# Altium schematic sheet Cpu.SchDoc
size A4
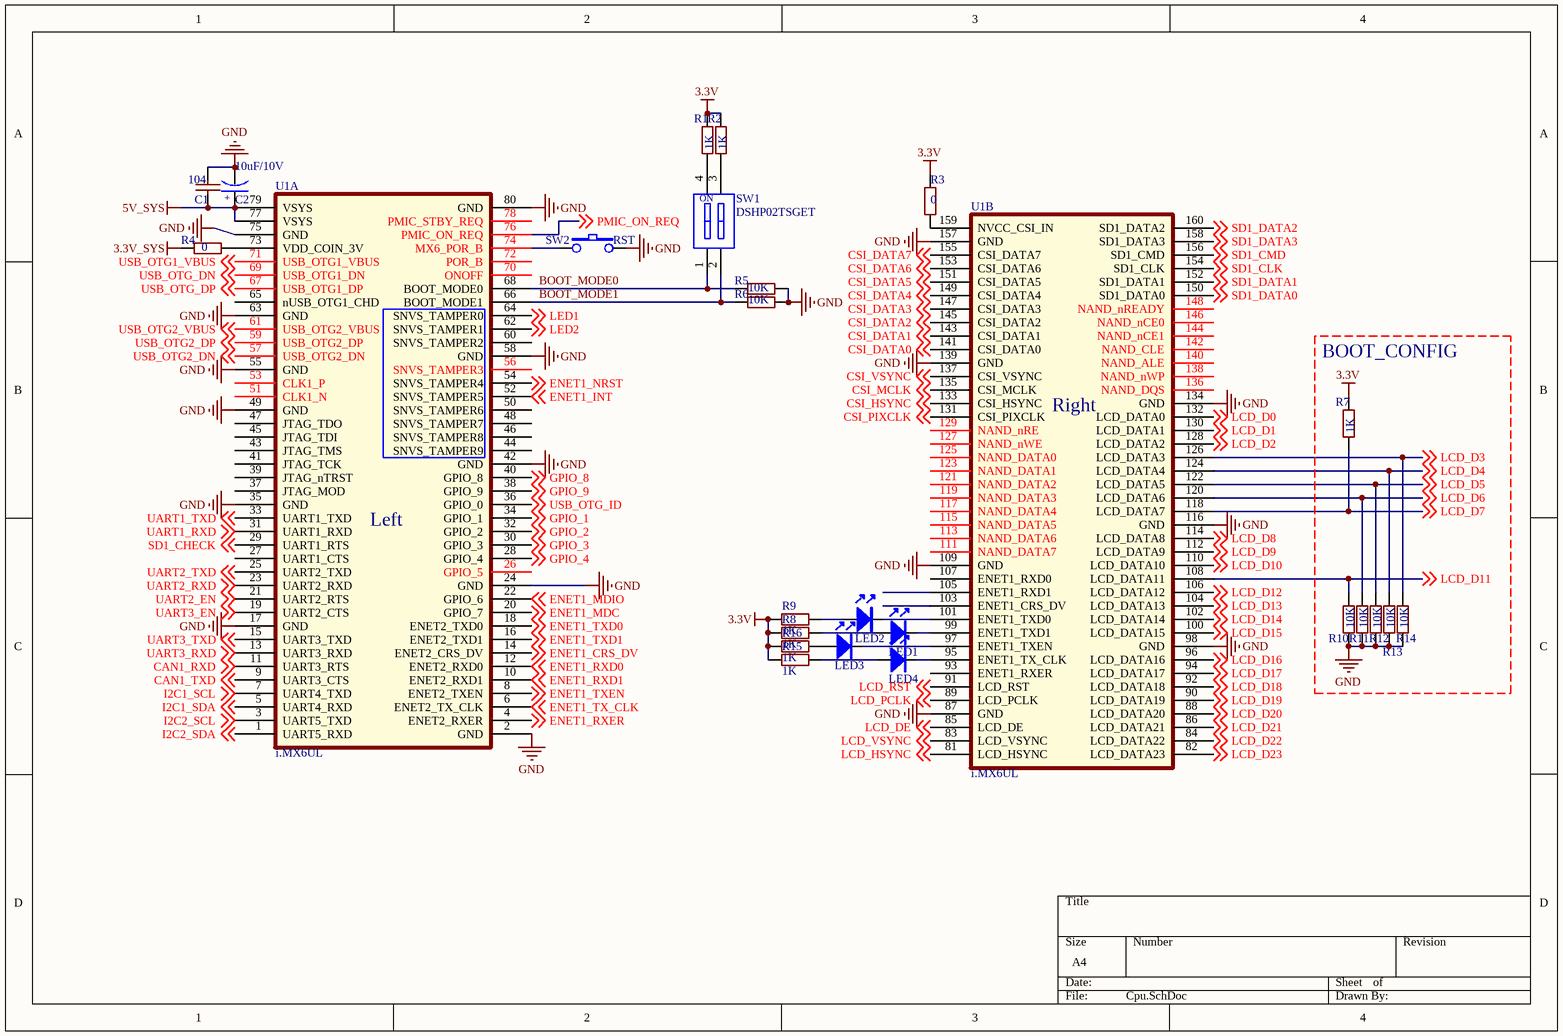
[diagram p0: Cpu.SchDoc]

## Parts
C1  104  [0805SMD_Cap]
C2  10uF/10V  [CASE A]
LED1  LED  [发光二极管0805]  (value not drawn)
LED2  LED  [发光二极管0805]  (value not drawn)
LED3  LED  [发光二极管0805]  (value not drawn)
LED4  LED  [发光二极管0805]  (value not drawn)
R1  1K  [0805_SMD_R]
R2  1K  [0805_SMD_R]
R3  0  [0805_SMD_R]
R4  0  [0805_SMD_R]
R5  10K  [0805_SMD_R]
R6  10K  [0805_SMD_R]
R7  1K  [0805_SMD_R]
R8  1K  [0805_SMD_R]
R9  1K  [0805_SMD_R]
R10  10K  [0805_SMD_R]
R11  10K  [0805_SMD_R]
R12  10K  [0805_SMD_R]
R13  10K  [0805_SMD_R]
R14  10K  [0805_SMD_R]
R15  1K  [0805_SMD_R]
R16  1K  [0805_SMD_R]
SW1  DSHP02TSGET  [DSHP02TSGET]
SW2  RST  [SW4]
U1  i.MX6UL  [i.MX6_PCB]  (parts A,B of 2)

## Blocks framed on the sheet
BOOT_CONFIG: R7 R10-R14

## Nets
3.3V: R1.2 R2.2 R3.1 R7.2 R8.1 R9.1 R15.2 R16.2
3.3V_SYS: R4.2
5V_SYS: C1.2 C2.1 U1.77(VSYS) U1.79(VSYS)
GND: C1.1 C2.2 R5.1 R6.1 R10.1 R11.1 R12.1 R13.1 R14.1 SW2.2 U1.2(GND) U1.17(GND) U1.24(GND) U1.35(GND) U1.42(GND) U1.49(GND) U1.55(GND) U1.58(GND) U1.63(GND) U1.75(GND) U1.80(GND) U1.87(GND) U1.98(GND) U1.109(GND) U1.116(GND) U1.134(GND) U1.139(GND) U1.157(GND)
BOOT_MODE0: R5.2 SW1.1(A1) U1.68(BOOT_MODE0)
BOOT_MODE1: R6.2 SW1.2(A2) U1.66(BOOT_MODE1)
CAN1_RXD: U1.11(UART3_RTS) ; off-sheet CAN1_RXD
CAN1_TXD: U1.9(UART3_CTS) ; off-sheet CAN1_TXD
CSI_DATA0: U1.141(CSI_DATA0) ; off-sheet CSI_DATA0
CSI_DATA1: U1.143(CSI_DATA1) ; off-sheet CSI_DATA1
CSI_DATA2: U1.145(CSI_DATA2) ; off-sheet CSI_DATA2
CSI_DATA3: U1.147(CSI_DATA3) ; off-sheet CSI_DATA3
CSI_DATA4: U1.149(CSI_DATA4) ; off-sheet CSI_DATA4
CSI_DATA5: U1.151(CSI_DATA5) ; off-sheet CSI_DATA5
CSI_DATA6: U1.153(CSI_DATA6) ; off-sheet CSI_DATA6
CSI_DATA7: U1.155(CSI_DATA7) ; off-sheet CSI_DATA7
CSI_HSYNC: U1.133(CSI_HSYNC) ; off-sheet CSI_HSYNC
CSI_MCLK: U1.135(CSI_MCLK) ; off-sheet CSI_MCLK
CSI_PIXCLK: U1.131(CSI_PIXCLK) ; off-sheet CSI_PIXCLK
CSI_VSYNC: U1.137(CSI_VSYNC) ; off-sheet CSI_VSYNC
ENET1_CRS_DV: U1.14(ENET2_CRS_DV) ; off-sheet ENET1_CRS_DV
ENET1_INT: U1.52(SNVS_TAMPER5) ; off-sheet ENET1_INT
ENET1_MDC: U1.20(GPIO_7) ; off-sheet ENET1_MDC
ENET1_MDIO: U1.22(GPIO_6) ; off-sheet ENET1_MDIO
ENET1_NRST: U1.54(SNVS_TAMPER4) ; off-sheet ENET1_NRST
ENET1_RXD0: U1.12(ENET2_RXD0) ; off-sheet ENET1_RXD0
ENET1_RXD1: U1.10(ENET2_RXD1) ; off-sheet ENET1_RXD1
ENET1_RXER: U1.4(ENET2_RXER) ; off-sheet ENET1_RXER
ENET1_TX_CLK: U1.6(ENET2_TX_CLK) ; off-sheet ENET1_TX_CLK
ENET1_TXD0: U1.18(ENET2_TXD0) ; off-sheet ENET1_TXD0
ENET1_TXD1: U1.16(ENET2_TXD1) ; off-sheet ENET1_TXD1
ENET1_TXEN: U1.8(ENET2_TXEN) ; off-sheet ENET1_TXEN
GPIO_1: U1.34(GPIO_1) ; off-sheet GPIO_1
GPIO_2: U1.32(GPIO_2) ; off-sheet GPIO_2
GPIO_3: U1.30(GPIO_3) ; off-sheet GPIO_3
GPIO_4: U1.28(GPIO_4) ; off-sheet GPIO_4
GPIO_8: U1.40(GPIO_8) ; off-sheet GPIO_8
GPIO_9: U1.38(GPIO_9) ; off-sheet GPIO_9
I2C1_SCL: U1.7(UART4_TXD) ; off-sheet I2C1_SCL
I2C1_SDA: U1.5(UART4_RXD) ; off-sheet I2C1_SDA
I2C2_SCL: U1.3(UART5_TXD) ; off-sheet I2C2_SCL
I2C2_SDA: U1.1(UART5_RXD) ; off-sheet I2C2_SDA
LCD_D0: U1.132(LCD_DATA0) ; off-sheet LCD_D0
LCD_D1: U1.130(LCD_DATA1) ; off-sheet LCD_D1
LCD_D2: U1.128(LCD_DATA2) ; off-sheet LCD_D2
LCD_D3: R14.2 U1.126(LCD_DATA3) ; off-sheet LCD_D3
LCD_D4: R13.2 U1.124(LCD_DATA4) ; off-sheet LCD_D4
LCD_D5: R12.2 U1.122(LCD_DATA5) ; off-sheet LCD_D5
LCD_D6: R11.2 U1.120(LCD_DATA6) ; off-sheet LCD_D6
LCD_D7: R7.1 U1.118(LCD_DATA7) ; off-sheet LCD_D7
LCD_D8: U1.114(LCD_DATA8) ; off-sheet LCD_D8
LCD_D9: U1.112(LCD_DATA9) ; off-sheet LCD_D9
LCD_D10: U1.110(LCD_DATA10) ; off-sheet LCD_D10
LCD_D11: R10.2 U1.108(LCD_DATA11) ; off-sheet LCD_D11
LCD_D12: U1.106(LCD_DATA12) ; off-sheet LCD_D12
LCD_D13: U1.104(LCD_DATA13) ; off-sheet LCD_D13
LCD_D14: U1.102(LCD_DATA14) ; off-sheet LCD_D14
LCD_D15: U1.100(LCD_DATA15) ; off-sheet LCD_D15
LCD_D16: U1.96(LCD_DATA16) ; off-sheet LCD_D16
LCD_D17: U1.94(LCD_DATA17) ; off-sheet LCD_D17
LCD_D18: U1.92(LCD_DATA18) ; off-sheet LCD_D18
LCD_D19: U1.90(LCD_DATA19) ; off-sheet LCD_D19
LCD_D20: U1.88(LCD_DATA20) ; off-sheet LCD_D20
LCD_D21: U1.86(LCD_DATA21) ; off-sheet LCD_D21
LCD_D22: U1.84(LCD_DATA22) ; off-sheet LCD_D22
LCD_D23: U1.82(LCD_DATA23) ; off-sheet LCD_D23
LCD_DE: U1.85(LCD_DE) ; off-sheet LCD_DE
LCD_HSYNC: U1.81(LCD_HSYNC) ; off-sheet LCD_HSYNC
LCD_PCLK: U1.89(LCD_PCLK) ; off-sheet LCD_PCLK
LCD_RST: U1.91(LCD_RST) ; off-sheet LCD_RST
LCD_VSYNC: U1.83(LCD_VSYNC) ; off-sheet LCD_VSYNC
LED1: U1.64(SNVS_TAMPER0) ; off-sheet LED1
LED2: U1.62(SNVS_TAMPER1) ; off-sheet LED2
PMIC_ON_REQ: U1.76(PMIC_ON_REQ) ; off-sheet PMIC_ON_REQ
SD1_CHECK: U1.29(UART1_RTS) ; off-sheet SD1_CHECK
SD1_CLK: U1.154(SD1_CLK) ; off-sheet SD1_CLK
SD1_CMD: U1.156(SD1_CMD) ; off-sheet SD1_CMD
SD1_DATA0: U1.150(SD1_DATA0) ; off-sheet SD1_DATA0
SD1_DATA1: U1.152(SD1_DATA1) ; off-sheet SD1_DATA1
SD1_DATA2: U1.160(SD1_DATA2) ; off-sheet SD1_DATA2
SD1_DATA3: U1.158(SD1_DATA3) ; off-sheet SD1_DATA3
UART1_RXD: U1.31(UART1_RXD) ; off-sheet UART1_RXD
UART1_TXD: U1.33(UART1_TXD) ; off-sheet UART1_TXD
UART2_EN: U1.21(UART2_RTS) ; off-sheet UART2_EN
UART2_RXD: U1.23(UART2_RXD) ; off-sheet UART2_RXD
UART2_TXD: U1.25(UART2_TXD) ; off-sheet UART2_TXD
UART3_EN: U1.19(UART2_CTS) ; off-sheet UART3_EN
UART3_RXD: U1.13(UART3_RXD) ; off-sheet UART3_RXD
UART3_TXD: U1.15(UART3_TXD) ; off-sheet UART3_TXD
USB_OTG1_VBUS: U1.71(USB_OTG1_VBUS) ; off-sheet USB_OTG1_VBUS
USB_OTG2_DN: U1.57(USB_OTG2_DN) ; off-sheet USB_OTG2_DN
USB_OTG2_DP: U1.59(USB_OTG2_DP) ; off-sheet USB_OTG2_DP
USB_OTG2_VBUS: U1.61(USB_OTG2_VBUS) ; off-sheet USB_OTG2_VBUS
USB_OTG_DN: U1.69(USB_OTG1_DN) ; off-sheet USB_OTG_DN
USB_OTG_DP: U1.67(USB_OTG1_DP) ; off-sheet USB_OTG_DP
USB_OTG_ID: U1.36(GPIO_0) ; off-sheet USB_OTG_ID
NetLED1_A: LED1.A R8.2
NetLED1_K: LED1.K U1.99(ENET1_TXD1)
NetLED2_A: LED2.A R9.2
NetLED2_K: LED2.K U1.101(ENET1_TXD0)
NetLED3_A: LED3.A R16.1
NetLED3_K: LED3.K U1.97(ENET1_TXEN)
NetLED4_A: LED4.A R15.1
NetLED4_K: LED4.K U1.95(ENET1_TX_CLK)
NetR1_1: R1.1 SW1.4(B1)
NetR2_1: R2.1 SW1.3(B2)
NetR3_2: R3.2 U1.159(NVCC_CSI_IN)
NetR4_1: R4.1 U1.73(VDD_COIN_3V)
NetSW2_1: SW2.1 U1.74(MX6_POR_B)

Not connected (* = marked no-connect by the designer): U1 26(GPIO_5) 27(UART1_CTS) 37(JTAG_MOD) 39(JTAG_nTRST) 41(JTAG_TCK) 43(JTAG_TMS) 44(SNVS_TAMPER9) 45(JTAG_TDI) 46(SNVS_TAMPER8) 47(JTAG_TDO) 48(SNVS_TAMPER7) 50(SNVS_TAMPER6) 51(CLK1_N) 53(CLK1_P) 56(SNVS_TAMPER3) 60(SNVS_TAMPER2) 65(nUSB_OTG1_CHD) 70(ONOFF) 72(POR_B) 78(PMIC_STBY_REQ) 93(ENET1_RXER) 103(ENET1_CRS_DV) 105(ENET1_RXD1) 107(ENET1_RXD0) 111(NAND_DATA7) 113(NAND_DATA6) 115(NAND_DATA5) 117(NAND_DATA4) 119(NAND_DATA3) 121(NAND_DATA2) 123(NAND_DATA1) 125(NAND_DATA0) 127(NAND_nWE) 129(NAND_nRE) 136(NAND_DQS) 138(NAND_nWP) 140(NAND_ALE) 142(NAND_CLE) 144(NAND_nCE1) 146(NAND_nCE0) 148(NAND_nREADY)

## Notes on the sheet
- (in symbol CAP  POL) +
- (in symbol i.MX6_Sch, part A) Left
- (in symbol i.MX6_Sch, part B) Right
- (in symbol 拨码开关) ON

## Library data of the parts
C1 = SMD_Cap: 贴片电容; 研究所: 贴装电容_0805_0.1uF; 松下: GR21BB1H104K; 松下: GR21BB1H224K; 松下: GR21BB1H103K; 研究所: 贴装电容_0805_0.22uF; 研究所: 贴装电容_0805_0.01uF; 松下: GR21BB1H473K; 研究所: 贴装电容_0805_0.047uF; 松下: GR21BB1H300K; 研究所: 贴装电容_0805_30pF; 松下: GR21BB1H105K; 研究所: 贴装电容_0805_1uF; 松下: GR21BB1H472K; 研究所: 贴装电容_0805_4700pF
C2 = CAP  POL: 电解电容; Value: R1HCX010MT50
LED1-LED4 = LED: 发光二极管
R1-R16 = SMD_0805: 贴片电阻; 松下: RS05K101FT; 松下: RS05000FT; 松下: RS05K3321FT; 松下: RS05K6811FT; 松下: RS05K102FT; 松下: RS05K2211FT; 松下: RS05K103FT; 松下: RS05K5111FT; 松下: RS05K5110FT; 松下: RS05K5112FT; 松下: RS05K8251FT; 松下: RS05K2212FT; 松下: RS05K104FT; 松下: RS05K5113FT; 松下: RS05K105FT; 松下: RS05L106FT; 研究所: 贴装电阻_0805_0_F1%; 研究所: 贴装电阻_0805_100_F1%; 研究所: 贴装电阻_0805_51.1K_F1%; 研究所: 贴装电阻_0805_1K_F1%; 研究所: 贴装电阻_0805_2.21K_F1%; 研究所: 贴装电阻_0805_3.32K_F1%; 研究所: 贴装电阻_0805_5.11K_F1%; 研究所: 贴装电阻_0805_511K_F1%; 研究所: 贴装电阻_0805_6.81K_F1%; 研究所: 贴装电阻_0805_511_F1%; 研究所: 贴装电阻_0805_8.25K_F1%; 研究所: 贴装电阻_0805_10K_F1%; 研究所: 贴装电阻_0805_22.1K_F1%; 研究所: 贴装电阻_0805_100K_F1%; 研究所: 贴装电阻_0805_1M_F1%; 研究所: 贴装电阻_0805_10M_F1%
SW1 = 拨码开关
SW2 = Button: 按键12*12*7.3
U1 = i.MX6_Sch